# Altium schematic sheet Power.SchDoc: MAIN BLOCK & POWER
size A4; SheetNumber: 1; SheetTotal: 3
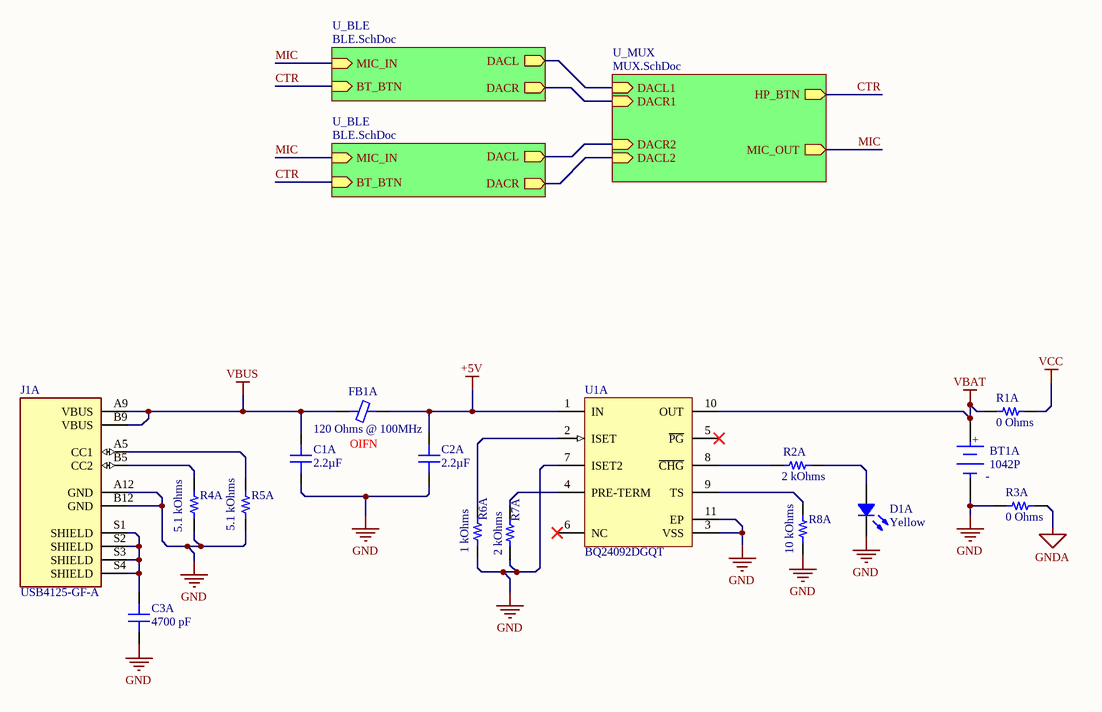
[diagram p0: Power.SchDoc]

## Parts
BT1A  1042P  [FP-1042P-MFG]
C1A  2.2µF  [CAP 0402_1005]
C2A  2.2µF  [CAP 0402_1005]
C3A  4700 pF  [CAP 0402_1005]
D1A  Yellow  [LED 0402_1005 YELLOW]
FB1A  120 Ohms @ 100MHz  [FER 0201_0603]
J1A  USB4125-GF-A  [USB4125-GF-A]
R1A  0 Ohms  [RES 0603_1608]
R2A  2 kOhms  [RES 0402_1005]
R3A  0 Ohms  [RES 0603_1608]
R4A  5.1 kOhms  [RES 0402_1005]
R5A  5.1 kOhms  [RES 0402_1005]
R6A  1 kOhms  [RES 0402_1005]
R7A  2 kOhms  [RES 0402_1005]
R8A  10 kOhms  [RES 0402_1005]
U1A  BQ24092DGQT  [DGQ0010D_L]

## Sub-sheets
U_BLE = BLE.SchDoc: DACR (out), DACL (out), MIC_IN (in), BT_BTN (in)
U_BLE = BLE.SchDoc: DACR (out), DACL (out), MIC_IN (in), BT_BTN (in)
U_MUX = MUX.SchDoc: DACL1 (in), DACL2 (in), DACR1 (in), DACR2 (in), HP_BTN (out), MIC_OUT (out)

## Nets
+5V: C2A.2 FB1A.2 U1A.1(IN)
GND: BT1A.1(C) C1A.1 C2A.1 C3A.1 D1A.2 J1A.A12(GND) J1A.B12(GND) R3A.1 R4A.1 R5A.1 R6A.1 R7A.1 R8A.1 U1A.3(VSS) U1A.7(ISET2) U1A.11(EP)
GNDA: R3A.2
VBAT: BT1A.2(A) R1A.1 U1A.10(OUT)
VBUS: C1A.2 FB1A.1 J1A.A9(VBUS) J1A.B9(VBUS)
VCC: R1A.2
CTR: sheet U_BLE/BT_BTN, sheet U_MUX/HP_BTN, sheet U_BLE/BT_BTN
MIC: sheet U_BLE/MIC_IN, sheet U_MUX/MIC_OUT, sheet U_BLE/MIC_IN
NetC3A_2: C3A.2 J1A.S1(SHIELD) J1A.S2(SHIELD) J1A.S3(SHIELD) J1A.S4(SHIELD)
NetD1A_1: D1A.1 R2A.1
NetJ1A_A5: J1A.A5(CC1) R5A.2
NetJ1A_B5: J1A.B5(CC2) R4A.2
NetR2A_2: R2A.2 U1A.8(~{CHG})
NetR6A_2: R6A.2 U1A.2(ISET)
NetR7A_2: R7A.2 U1A.4(PRE-TERM)
NetR8A_2: R8A.2 U1A.9(TS)
(unnamed): sheet U_BLE/DACR, sheet U_MUX/DACR1
(unnamed): sheet U_BLE/DACL, sheet U_MUX/DACL1
(unnamed): sheet U_MUX/DACL2, sheet U_BLE/DACR
(unnamed): sheet U_MUX/DACR2, sheet U_BLE/DACL

Not connected (* = marked no-connect by the designer): U1A 5(~{PG})* 6(NC)*

## Notes on the sheet
- (near FB1A) OIFN
- THIS DOCUMENT AND THE DATA DISCLOSED HEREIN OR
- HEREWITH IS THE PROPERTY OF SPD Ind.
- ENG:
- DHARAGESWARAN S
- APPROVALS
- DATE
- PROJECT
- DSN:
- CHK:
- REFERENCE DOCUMENTS
- PROJECT REVISION:
- TITLE
- DOCUMENT REVISION:
- Email: sdhamuvkl@gmail.com <https://github.com/DhamuVkl>
- BOM:
- FAB DWG:
- PCB DWG:
- ASSY DWG:
- SCALE:
- A4
- SIZE
- CAGE CODE
- FILE NAME
- DWG NO.
- SHEET
- REV
- OF
- (in symbol CMP-19636-000019-1) +; -

## Library data of the parts
BT1A = CMP-19636-000019-1: BATTERY HOLDER 18650 SMD TAB; Number of Cells: 1; Max Operating Temperature: 145°C; Termination: SMD/SMT; Mount: Surface Mount; Min Operating Temperature: -50°C; Package Quantity: 200; Packaging: Tray; Lead Free: Lead Free
C1A C2A = 0402ZD225KAT2A: CAP CER 2.2UF 10V X5R 0402; Manufacturer: AVX Corporation; id: 2335; Tolerance: ±10%; Part Number: 0402ZD225KAT2A; Value: 2.2µF; Temperature Coefficient: X5R; Supplier Part Number 1: 478-10072-1-ND; ComponentLink2Description: DigiKey Link; ComponentLink1URL: http://datasheets.avx.com/cx5r.pdf; PartId: 9346; Supplier 1: DigiKey; Series: -; LastUpdated: 2022-02-08T12:26:45.707; Part Status: Active; Capacitance: 2.2µF; Device Package: 0402 (1005 Metric); Thickness (Max): 0.022" (0.56mm); Voltage - Rated: 10V; Minimum Order: 1; Packaging: TapeAndReel; Applications: General Purpose; Package / Case: 0402 (1005 Metric); ComponentLink1Description: Datasheet; Price: 0.09; ComponentLink2URL: http://digikey.com/product-detail/en/avx-corporation/0402ZD225KAT2A/478-10072-1-ND/6564294; Lifecycle Status: Active; Operating Temperature: -55°C ~ 85°C; Size / Dimension: 0.039" L x 0.020" W (1.00mm x 0.50mm); Mounting Type: Surface Mount, MLCC
C3A = C0402C472K4RECAUTO: CAP CER 0402 4.7NF 16V X7R 10%; Manufacturer: KEMET; id: 3032; Part Number: C0402C472K4RECAUTO; Value: 4700 pF; Temperature Coefficient: X7R; Supplier Part Number 1: 399-17875-1-ND; ComponentLink2Description: DigiKey Link; ComponentLink1URL: https://api.kemet.com/component-edge/download/datasheet/C0402C472K4RECAUTO.pdf; PartId: 12122; Tolerance: ±10%; Supplier 1: DigiKey; Series: ESD SMD Auto X7R; LastUpdated: 2023-01-03T20:03:46.940; Part Status: Active; Capacitance: 4700 pF; Device Package: 0402 (1005 Metric); Ratings: AEC-Q200; Thickness (Max): 0.022" (0.55mm); Voltage - Rated: 16V; Minimum Order: 1; Packaging: TapeAndReel; Applications: Automotive, ESD Protection; Package / Case: 0402 (1005 Metric); ComponentLink1Description: Datasheet; Price: 0.01; ComponentLink2URL: https://www.digikey.com/en/products/detail/kemet/C0402C472K4RECAUTO/8640469; Lifecycle Status: Active; Operating Temperature: -55°C ~ 125°C; Size / Dimension: 0.039" L x 0.020" W (1.00mm x 0.50mm); Mounting Type: Surface Mount, MLCC
D1A = XZMYK68W-2: LED YELLOW CLEAR CHIP SMD; Manufacturer: SunLED; id: 167; Lens Color: Colorless; Wavelength - Peak: 590nm; Lens Style: Rectangle with Flat Top; Viewing Angle: 120°; Lens Size: 0.80mm x 0.50mm; Configuration: Standard; Voltage - Forward (Vf) (Typ): 2V; Current - Test: 20mA; Millicandela Rating: 148mcd; Part Number: XZMYK68W-2; Supplier Part Number 1: 1497-1198-1-ND; Lens Transparency: Clear; Supplier Device Package: Chip LED; ComponentLink1Description: Datasheet; Color: Yellow; ComponentLink2URL: https://www.digikey.com/en/products/detail/sunled/XZMYK68W-2/4745801; ComponentLink1URL: https://www.sunledusa.com/products/spec/XZMYK68W-2.pdf; Supplier 1: DigiKey; Series: -; Height (Max): 0.60mm; Part Status: Active; ComponentLink2Description: DigiKey Link; Device Package: 0402 (1005 Metric); Packaging: TapeAndReel; Minimum Order: 1; Package / Case: 0402 (1005 Metric); PartId: 167; Wavelength - Dominant: 590nm; Lifecycle Status: Active; LastUpdated: 2023-01-02T20:57:30.307; Value: Yellow; Size / Dimension: 1.00mm L x 0.50mm W; Mounting Type: Surface Mount; Price: 0.05
FB1A = BKP0603HM121-T: FERRITE BEAD 120 OHM 0201 1LN; Manufacturer: Taiyo Yuden; id: 127; DC Resistance (DCR) (Max): 180mOhm; Number Of Lines: 1; Filter Type: Power Line; Current Rating (Max): 800mA; Part Number: BKP0603HM121-T; Supplier Part Number 1: 587-3283-1-ND; ComponentLink1Description: Datasheet; ComponentLink2URL: http://digikey.com/product-detail/en/taiyo-yuden/BKP0603HM121-T/587-3283-1-ND/4157927; ComponentLink1URL: https://ds.yuden.co.jp/TYCOMPAS/ut/detail?pn=BKP0603HM121-T  &u=M; Supplier 1: DigiKey; Series: BK; Height (Max): 0.013" (0.33mm); Part Status: Active; ComponentLink2Description: DigiKey Link; Device Package: 0201 (0603 Metric); Impedance @ Frequency: 120 Ohms @ 100MHz; Packaging: TapeAndReel; Minimum Order: 1; Package / Case: 0201 (0603 Metric); PartId: 127; Lifecycle Status: Active; LastUpdated: 2023-01-02T20:50:51.660; Operating Temperature: -55°C ~ 85°C; Value: 120 Ohms @ 100MHz; Size / Dimension: 0.024" L x 0.012" W (0.60mm x 0.30mm); Mounting Type: Surface Mount; Price: 0.03
J1A = USB4125-GF-A: CONN RCPT TYPE C 6P SMD RA; Manufacturer: GCT; MP: USB4125-GF-A_REVA2; id: 21; Mating Cycles: 20000; Current Rating (Amps): 3A; Connector Type: USB-C (USB TYPE-C); Number Of Contacts: 24 (6+18 Dummy); Voltage - Rated: 20VDC; Shielding: Shielded; Number Of Ports: 1; Gender: Receptacle; Package: None; Availability: Unavailable; Value: *; Price: 0.67; Part Number: USB4125-GF-A; Supplier Part Number 1: 2073-USB4125-GF-ACT-ND; Specifications: -; Termination: Solder; ComponentLink1Description: Datasheets; ComponentLink6URL: https://gct.co/files/info/gct_certificate_of_compliance.pdf; ComponentLink2URL: https://mm.digikey.com/Volume0/opasdata/d220001/medias/docus/5561/USB4125 - Product Spec.pdf; Features: Power Only, No Data; Solder Retention Tab; ComponentLink1URL: https://mm.digikey.com/Volume0/opasdata/d220001/medias/docus/5407/gct-usb-type-c-product-selection-guide-2023-v1.5_web.pdf; Mounting Feature: Horizontal; Supplier 1: DigiKey; Series: USB4125; ComponentLink6Description: Environmental Information; Part Status: Active; ComponentLink5URL: https://www.digikey.com/api/videos/videoplayer/smallplayer/6247993315001; Ingress Protection: -; ComponentLink2Description: Datasheets; Device Package: Cut Tape (CT); Packaging: Cut Tape (CT); ComponentLink5Description: Video File; Minimum Order: 1; Lifecycle Status: Active; LastUpdated: 2023-10-13T19:13:52.5975723; ComponentLink4URL: https://mm.digikey.com/Volume0/opasdata/d220001/medias/images/2644/MFG_USB4125-GF-A.jpg; Operating Temperature: -30°C ~ 85°C; ComponentLink4Description: Product Photos; Mounting Type: Surface Mount, Right Angle; Through Hole; ComponentLink3Description: Datasheets; ComponentLink3URL: https://mm.digikey.com/Volume0/opasdata/d220001/medias/docus/5561/USB4125 - Product Drawing.pdf
R1A R3A = RCC06030000Z0EA: RCC0603 0R0 ET1 E3; Manufacturer: Vishay Dale; id: 16538; Tolerance: Jumper; Power (Watts): 0.2W, 1/5W; Part Number: RCC06030000Z0EA; Height - Seated (Max): 0.020" (0.50mm); Supplier Part Number 1: 541-RCC06030000Z0EACT-ND; Supplier Device Package: 0603; ComponentLink1Description: Datasheet; ComponentLink2URL: https://www.digikey.com/en/products/detail/vishay-dale/RCC06030000Z0EA/12084250; Features: Automotive AEC-Q200; ComponentLink1URL: https://www.vishay.com/docs/20066/rcce3.pdf; Composition: Thick Film; Supplier 1: DigiKey; Series: RCC e3; Part Status: Active; ComponentLink2Description: DigiKey Link; Device Package: 0603 (1608 Metric); Packaging: TapeAndReel; Ratings: AEC-Q200; Minimum Order: 1; Package / Case: 0603 (1608 Metric); PartId: 67023; Lifecycle Status: Active; LastUpdated: 2023-01-02T20:27:57.037; Operating Temperature: -55°C ~ 155°C; Number Of Terminations: 2; Value: 0 Ohms; Size / Dimension: 0.061" L x 0.033" W (1.55mm x 0.85mm); Price: 0.01; Resistance: 0 Ohms
R2A R7A = AC0402FR-7W2KL: RES 2K OHM 1% 1/8W 0402; Manufacturer: Yageo; id: 15390; Temperature Coefficient: ±100ppm/°C; Power (Watts): 0.125W, 1/8W; Part Number: AC0402FR-7W2KL; Height - Seated (Max): 0.015" (0.37mm); Supplier Part Number 1: 13-AC0402FR-7W2KLCT-ND; Supplier Device Package: 0402; ComponentLink1Description: Datasheet; ComponentLink2URL: https://www.digikey.com/en/products/detail/yageo/AC0402FR-7W2KL/16990150; Features: Automotive AEC-Q200, Moisture Resistant; ComponentLink1URL: https://www.yageo.com/upload/media/product/productsearch/datasheet/rchip/PYu-AC_51_RoHS_L_10.pdf; Composition: Thick Film; Tolerance: ±1%; Supplier 1: DigiKey; Series: AC; ComponentLink2Description: DigiKey Link; Device Package: 0402 (1005 Metric); Packaging: CutTape; Ratings: AEC-Q200; Minimum Order: 1; Package / Case: 0402 (1005 Metric); PartId: 81829; Lifecycle Status: Active; LastUpdated: 2023-10-29T19:24:41.980; Operating Temperature: -55°C ~ 155°C; Number Of Terminations: 2; Value: 2 kOhms; Size / Dimension: 0.039" L x 0.020" W (1.00mm x 0.50mm); Price: 0.01; Resistance: 2 kOhms
R4A R5A = AC0402FR-075K1L: RES SMD 5.1K OHM 1% 1/16W 0402; Manufacturer: Yageo; id: 5028; Temperature Coefficient: ±100ppm/°C; Power (Watts): 0.063W, 1/16W; Part Number: AC0402FR-075K1L; Height - Seated (Max): 0.015" (0.37mm); Supplier Part Number 1: YAG3503CT-ND; Supplier Device Package: 0402; ComponentLink1Description: Datasheet; ComponentLink2URL: https://www.digikey.com/en/products/detail/yageo/AC0402FR-075K1L/5895438; Features: Automotive AEC-Q200, Moisture Resistant; ComponentLink1URL: https://www.yageo.com/upload/media/product/productsearch/datasheet/rchip/PYu-AC_51_RoHS_L_7.pdf; Composition: Thick Film; Tolerance: ±1%; Supplier 1: DigiKey; Series: AC; Part Status: Active; ComponentLink2Description: DigiKey Link; Device Package: 0402 (1005 Metric); Packaging: CutTape; Ratings: AEC-Q200; Minimum Order: 1; Package / Case: 0402 (1005 Metric); PartId: 12111; Lifecycle Status: Active; LastUpdated: 2023-01-02T20:21:09.567; Operating Temperature: -55°C ~ 155°C; Number Of Terminations: 2; Value: 5.1 kOhms; Size / Dimension: 0.039" L x 0.020" W (1.00mm x 0.50mm); Price: 0.01; Resistance: 5.1 kOhms
R6A = AC0402FR-071KL: RES SMD 1K OHM 1% 1/16W 0402; Manufacturer: Yageo; id: 4988; Temperature Coefficient: ±100ppm/°C; Power (Watts): 0.063W, 1/16W; Part Number: AC0402FR-071KL; Height - Seated (Max): 0.015" (0.37mm); Supplier Part Number 1: 311-1KLBCT-ND; Supplier Device Package: 0402; ComponentLink1Description: Datasheet; ComponentLink2URL: https://www.digikey.com/en/products/detail/yageo/AC0402FR-071KL/2827801; Features: Automotive AEC-Q200, Moisture Resistant; ComponentLink1URL: https://www.yageo.com/upload/media/product/productsearch/datasheet/rchip/PYu-AC_51_RoHS_L_7.pdf; Composition: Thick Film; Tolerance: ±1%; Supplier 1: DigiKey; Series: AC; Part Status: Active; ComponentLink2Description: DigiKey Link; Device Package: 0402 (1005 Metric); Packaging: CutTape; Ratings: AEC-Q200; Minimum Order: 1; Package / Case: 0402 (1005 Metric); PartId: 12037; Lifecycle Status: Active; LastUpdated: 2023-01-02T20:21:09.907; Operating Temperature: -55°C ~ 155°C; Number Of Terminations: 2; Value: 1 kOhms; Size / Dimension: 0.039" L x 0.020" W (1.00mm x 0.50mm); Price: 0.01; Resistance: 1 kOhms
R8A = AC0402FR-0710KL: RES SMD 10K OHM 1% 1/16W 0402; Manufacturer: Yageo; id: 4984; Temperature Coefficient: ±100ppm/°C; Power (Watts): 0.063W, 1/16W; Part Number: AC0402FR-0710KL; Height - Seated (Max): 0.015" (0.37mm); Supplier Part Number 1: YAG3436CT-ND; Supplier Device Package: 0402; ComponentLink1Description: Datasheet; ComponentLink2URL: https://www.digikey.com/en/products/detail/yageo/AC0402FR-0710KL/5895030; Features: Automotive AEC-Q200, Moisture Resistant; ComponentLink1URL: https://www.yageo.com/upload/media/product/productsearch/datasheet/rchip/PYu-AC_51_RoHS_L_7.pdf; Composition: Thick Film; Tolerance: ±1%; Supplier 1: DigiKey; Series: AC; Part Status: Active; ComponentLink2Description: DigiKey Link; Device Package: 0402 (1005 Metric); Packaging: CutTape; Ratings: AEC-Q200; Minimum Order: 1; Package / Case: 0402 (1005 Metric); PartId: 12029; Lifecycle Status: Active; LastUpdated: 2023-01-02T20:21:09.957; Operating Temperature: -55°C ~ 155°C; Number Of Terminations: 2; Value: 10 kOhms; Size / Dimension: 0.039" L x 0.020" W (1.00mm x 0.50mm); Price: 0.01; Resistance: 10 kOhms
U1A = CMP-0321-00905-2: 1 A, Single-Input, Single-Cell Li-Ion Battery Charger with Operation Over JEITA and 10 k ohm NTC, 4.5 V, -40 to 150 degC, 10-pin MSOP-PowerPAD (DGQ), Green (RoHS & no Sb/Br); Manufacturer: Texas Instruments; Over Voltage Protection: N; SubFamily: Battery Charge Management; Vin(Min)(V): 4.5; Eco-Plan: Green (RoHS & no Sb/Br); DatasheetVersion: SLUS968C; ComponentLink1URL: http://www.ti.com/general/docs/lit/getliterature.tsp?genericPartNumber=BQ24092&fileType=pdf; NiMH: N; Lead Acid: N; Li-Ion: N; Mounting Technology: Surface Mount; NiCd: N; PackageVersion: revF, Nov-2011; Code_JEDEC: MO-187-BA-T; ComponentLink1Description: Datasheet; PartNumber: BQ24092DGQT; Li-Polymer: N; PackageDescription: 10-Pin PowerPAD Plastic Small Outline 0.5 mm Pitch, Exposed Pad; PackageReference: DGQ0010D